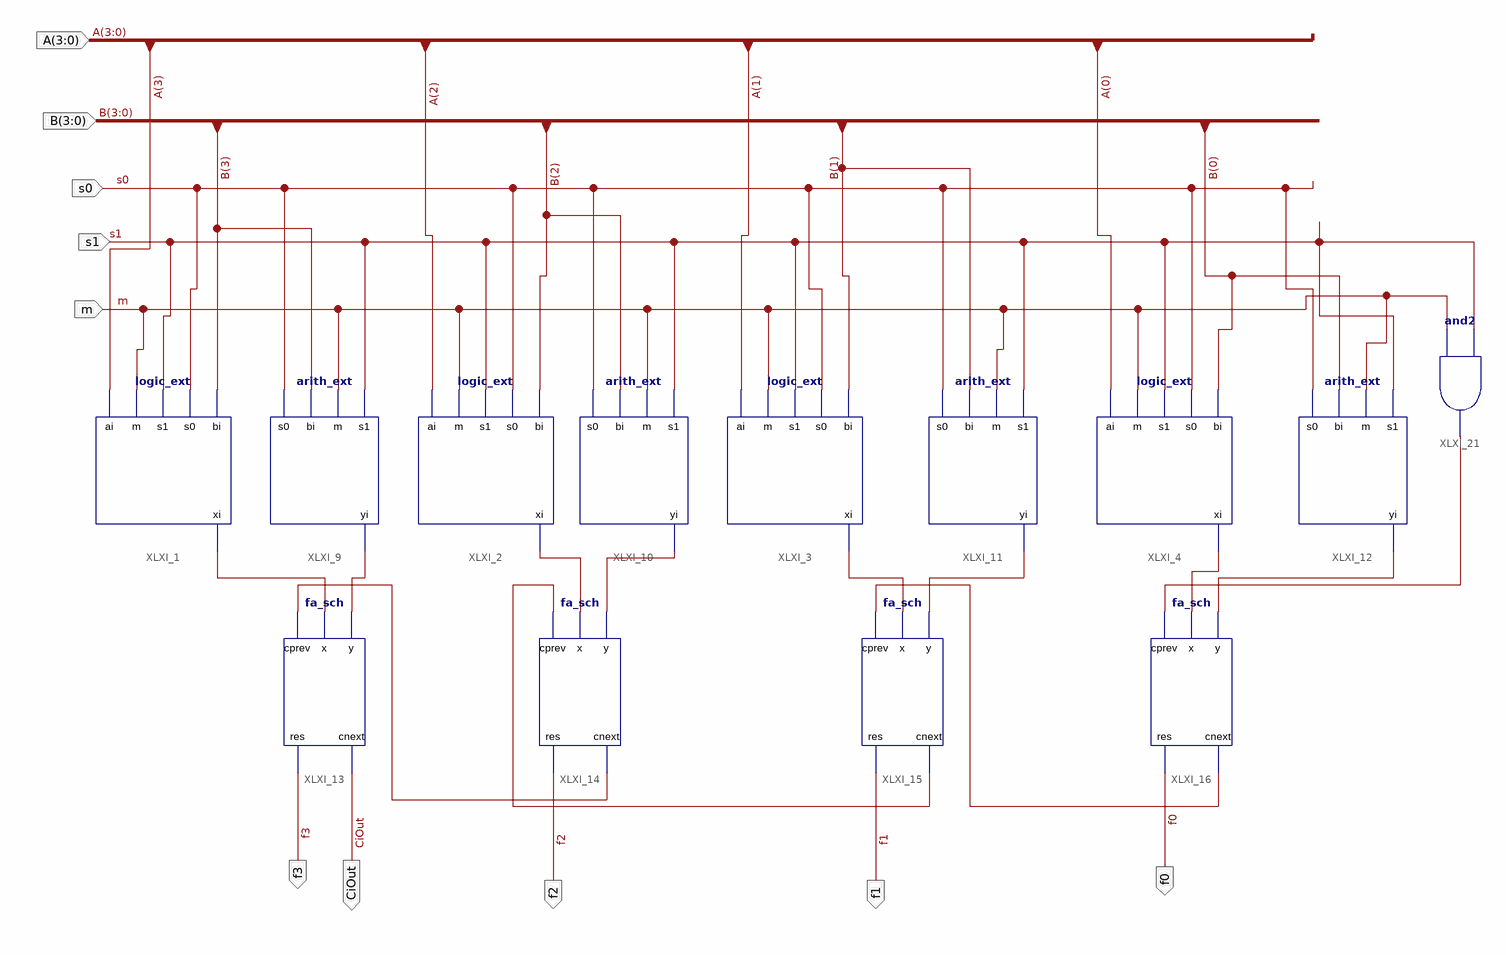
[diagram p0: schematic sheet 1]
// Xilinx ISE schematic alu4bit_sch.sch (spartan3e) as structural Verilog: 13 symbols, 10 ports
module alu4bit_sch (
  input  [3:0] A,
  input  s0,
  input  m,
  input  s1,
  input  [3:0] B,
  output CiOut,
  output f3,
  output f2,
  output f1,
  output f0
);

  wire XLXN_32, XLXN_34, XLXN_35, XLXN_36, XLXN_37, XLXN_38, XLXN_40, XLXN_41, XLXN_42, XLXN_43, XLXN_44,
       XLXN_50;

  logic_ext XLXI_4 (.bi(B[0]), .s0(s0), .s1(s1), .m(m), .ai(A[0]), .xi(XLXN_34));
  logic_ext XLXI_2 (.bi(B[2]), .s0(s0), .s1(s1), .m(m), .ai(A[2]), .xi(XLXN_40));
  logic_ext XLXI_3 (.bi(B[1]), .s0(s0), .s1(s1), .m(m), .ai(A[1]), .xi(XLXN_37));
  logic_ext XLXI_1 (.bi(B[3]), .s0(s0), .s1(s1), .m(m), .ai(A[3]), .xi(XLXN_43));
  arith_ext XLXI_9 (.s1(s1), .m(m), .bi(B[3]), .s0(s0), .yi(XLXN_44));
  arith_ext XLXI_10 (.s1(s1), .m(m), .bi(B[2]), .s0(s0), .yi(XLXN_38));
  arith_ext XLXI_11 (.s1(s1), .m(m), .bi(B[1]), .s0(s0), .yi(XLXN_36));
  arith_ext XLXI_12 (.s1(s1), .m(m), .bi(B[0]), .s0(s0), .yi(XLXN_50));
  fa_sch XLXI_16 (.y(XLXN_50), .x(XLXN_34), .cprev(XLXN_32), .cnext(XLXN_35), .res(f0));
  fa_sch XLXI_15 (.y(XLXN_36), .x(XLXN_37), .cprev(XLXN_35), .cnext(XLXN_41), .res(f1));
  fa_sch XLXI_14 (.y(XLXN_38), .x(XLXN_40), .cprev(XLXN_41), .cnext(XLXN_42), .res(f2));
  fa_sch XLXI_13 (.y(XLXN_44), .x(XLXN_43), .cprev(XLXN_42), .cnext(CiOut), .res(f3));
  and XLXI_21 (XLXN_32, m, s1);
endmodule
